# EAGLE schematic hurf1_schematic (EAGLE 8.2.2)
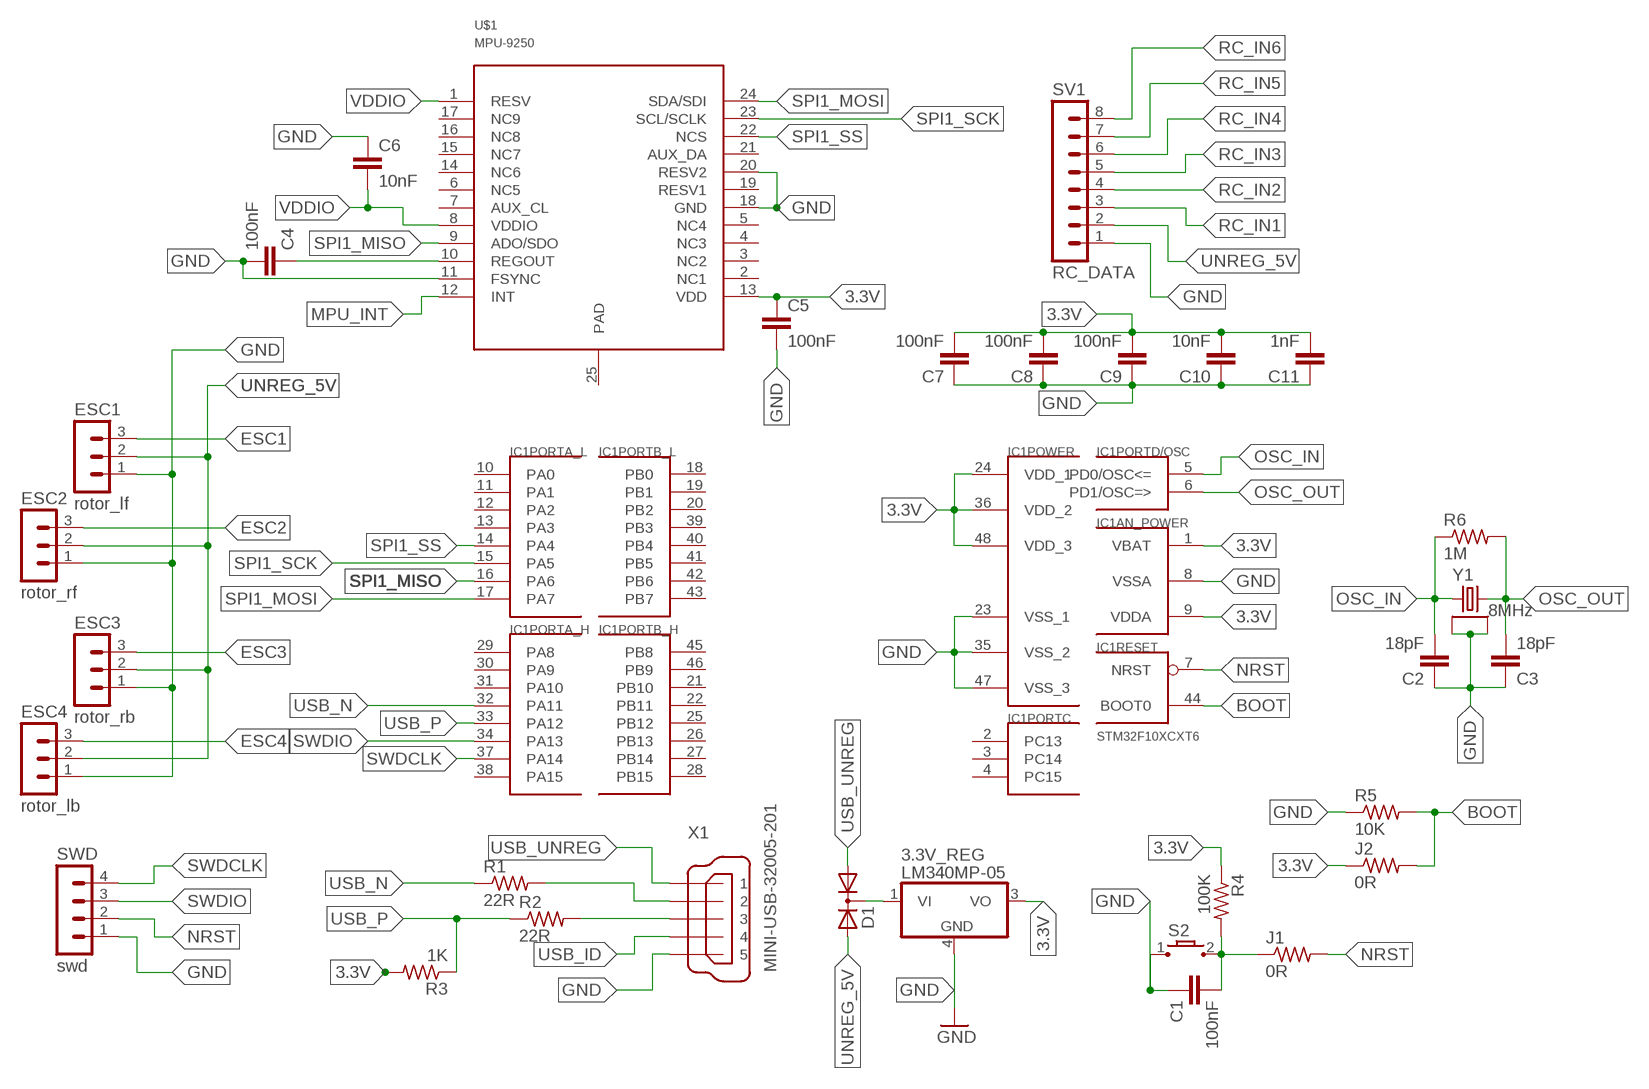
[diagram p0: schematic, sheet 1]

## Parts
3.3V_REG  LM340MP-05  [SOT223]
C1  100nF  C-EUC0805K  [C0805K]
C2  18pF  C-EUC0805K  [C0805K]
C3  18pF  C-EUC0805K  [C0805K]
C4  100nF  C-EUC0805K  [C0805K]
C5  100nF  C-EUC0805K  [C0805K]
C6  10nF  C-EUC0805K  [C0805K]
C7  100nF  C-EUC0805K  [C0805K]
C8  100nF  C-EUC0805K  [C0805K]
C9  100nF  C-EUC0805K  [C0805K]
C10  10nF  C-EUC0805K  [C0805K]
C11  1nF  C-EUC0805K  [C0805K]
D1  DIODE-2AC|CASOT23  [SOT23]
ESC1  rotor_lf  MA03-1  [MA03-1]
ESC2  rotor_rf  MA03-1  [MA03-1]
ESC3  rotor_rb  MA03-1  [MA03-1]
ESC4  rotor_lb  MA03-1  [MA03-1]
IC1  STM32F10XCXT6  [TQFP48]
J1  0R  R-US_M0805  [M0805]
J2  0R  R-US_M0805  [M0805]
R1  22R  R-US_M0805  [M0805]
R2  22R  R-US_M0805  [M0805]
R3  1K  R-US_M0805  [M0805]
R4  100K  R-US_M0805  [M0805]
R5  10K  R-US_M0805  [M0805]
R6  1M  R-US_M0805  [M0805]
S2  TL3302-G  [TL3302_GULL_WING]
SV1  RC_DATA  MA08-1  [MA08-1]
SWD  swd  MA04-1  [MA04-1]
U$1  MPU-9250  [LEAD-QFN24]
X1  MINI-USB-32005-201  [32005-201]
Y1  8MHz  GSX-531  [GSX-531]

## Nets
3.3V: 3.3V_REG.3(VO) C5.1 C7.2 C8.2 C9.2 C10.2 C11.2 IC1.1(AN_POWER:VBAT) IC1.9(AN_POWER:VDDA) IC1.24(POWER:VDD_1) IC1.36(POWER:VDD_2) IC1.48(POWER:VDD_3) J2.1 R3.2 R4.1 U$1.13(VDD)
BOOT: IC1.44(RESET:BOOT0) J2.2 R5.2
ESC1: ESC1.3
ESC2: ESC2.3
ESC3: ESC3.3
ESC4: ESC4.3
GND: 3.3V_REG.4(GND) C1.1 C2.1 C3.1 C4.2 C5.2 C6.1 C7.1 C8.1 C9.1 C10.1 C11.1 ESC1.1 ESC2.1 ESC3.1 ESC4.1 IC1.8(AN_POWER:VSSA) IC1.23(POWER:VSS_1) IC1.35(POWER:VSS_2) IC1.47(POWER:VSS_3) R5.1 S2.1 SV1.1 SWD.1 U$1.11(FSYNC) U$1.18(GND) U$1.20(RESV2) X1.5 Y1.2 Y1.4
MPU_INT: U$1.12(INT)
N$1: R1.2 X1.2
N$2: R2.2 X1.3
N$3: C4.1 U$1.10(REGOUT)
N$4: 3.3V_REG.1(VI) D1.3(C)
N$5: C1.2 J1.1 R4.2 S2.2
NRST: IC1.7(RESET:NRST) J1.2 SWD.2
OSC_IN: C2.2 IC1.5(PORTD/OSC:PD0/OSC<=) R6.1 Y1.1
OSC_OUT: C3.2 IC1.6(PORTD/OSC:PD1/OSC=>) R6.2 Y1.3
RC_IN1: SV1.3
RC_IN2: SV1.4
RC_IN3: SV1.5
RC_IN4: SV1.6
RC_IN5: SV1.7
RC_IN6: SV1.8
SPI1_MISO: IC1.16(PORTA_L:PA6) U$1.9(ADO/SDO)
SPI1_MOSI: IC1.17(PORTA_L:PA7) U$1.24(SDA/SDI)
SPI1_SCK: IC1.15(PORTA_L:PA5) U$1.23(SCL/SCLK)
SPI1_SS: IC1.14(PORTA_L:PA4) U$1.22(NCS)
SWDCLK: IC1.37(PORTA_H:PA14) SWD.4
SWDIO: IC1.34(PORTA_H:PA13) SWD.3
UNREG_5V: D1.2(A2) ESC1.2 ESC2.2 ESC3.2 ESC4.2 SV1.2
USB_ID: X1.4
USB_N: IC1.32(PORTA_H:PA11) R1.1
USB_P: IC1.33(PORTA_H:PA12) R2.1 R3.1
USB_UNREG: D1.1(A1) X1.1
VDDIO: C6.2 U$1.1(RESV) U$1.8(VDDIO)
Unconnected: IC1.2(PORTC:PC13) IC1.3(PORTC:PC14) IC1.4(PORTC:PC15) IC1.10(PORTA_L:PA0) IC1.11(PORTA_L:PA1) IC1.12(PORTA_L:PA2) IC1.13(PORTA_L:PA3) IC1.18(PORTB_L:PB0) IC1.19(PORTB_L:PB1) IC1.20(PORTB_L:PB2) IC1.21(PORTB_H:PB10) IC1.22(PORTB_H:PB11) IC1.25(PORTB_H:PB12) IC1.26(PORTB_H:PB13) IC1.27(PORTB_H:PB14) IC1.28(PORTB_H:PB15) IC1.29(PORTA_H:PA8) IC1.30(PORTA_H:PA9) IC1.31(PORTA_H:PA10) IC1.38(PORTA_H:PA15) IC1.39(PORTB_L:PB3) IC1.40(PORTB_L:PB4) IC1.41(PORTB_L:PB5) IC1.42(PORTB_L:PB6) IC1.43(PORTB_L:PB7) IC1.45(PORTB_H:PB8) IC1.46(PORTB_H:PB9) U$1.2(NC1) U$1.3(NC2) U$1.4(NC3) U$1.5(NC4) U$1.6(NC5) U$1.7(AUX_CL) U$1.14(NC6) U$1.15(NC7) U$1.16(NC8) U$1.17(NC9) U$1.19(RESV1) U$1.21(AUX_DA) U$1.25(PAD)

## Library data of the parts
3.3V_REG = linear:LM340?-*: Positive VOLTAGE REGULATOR Source: http://cache.national.com/ds/LM/LM340.pdf
C1-C11 = resistor:C-EU: CAPACITOR, European symbol
D1 = diode:DIODE-2AC|CA: Dual DIODE Anode-Cathode|Cathode-Anode
ESC1-ESC4 = con-lstb:MA03-1: PIN HEADER; OC_FARNELL: unknown; OC_NEWARK: unknown
IC1 = stm32:STM32F10XCXT6: ST STM32F101/103 48pin LQFP
J1 J2 R1-R6 = adafruit:R-US_: RESISTOR, American symbol
S2 = eswitch-tact:TL3302: E-Switch TL3302 Series Tactile Switch Surface mount button commonly used for reset or general input. 3.5 x 6mm packaged design. -G: Gull wing termination. Parts TL-3302-x-xxxx-x-G -J: J-Lead termination. Parts TL-3302-x-xxxx-x-J Source: http://www.e-switch.com/Portals/0/Series_Pdf/TL3302.pdf Supplier: DigiKey: http://be.digikey.com/scripts/dksearch/dksus.dll?vendor=0&keywords=TL3302
SV1 = con-lstb:MA08-1: PIN HEADER; OC_FARNELL: unknown; OC_NEWARK: unknown
SWD = con-lstb:MA04-1: PIN HEADER; OC_FARNELL: unknown; OC_NEWARK: unknown
U$1 = invensense:MPU-9250
X1 = con-cypressindustries:MINI-USB-: MINI USB-B Conector Source: www.cypressindustries.com; OC_FARNELL: unknown; OC_NEWARK: unknown
Y1 = Golledge:GSX-531: Crystal |SM| 5.0 x 3.2 mm | AT cut | Frequency Range 8 - 100 MHz Metal lid can be grounded to minimise EMI Seam seal for excellent long-term stability Tight specifications available Ultra-miniature for maximum space saving Datasheet <http://www.golledge.com/docs/products/xtl_sm/gsx531.htm?src=eagle>; HEIGHT: 0.9